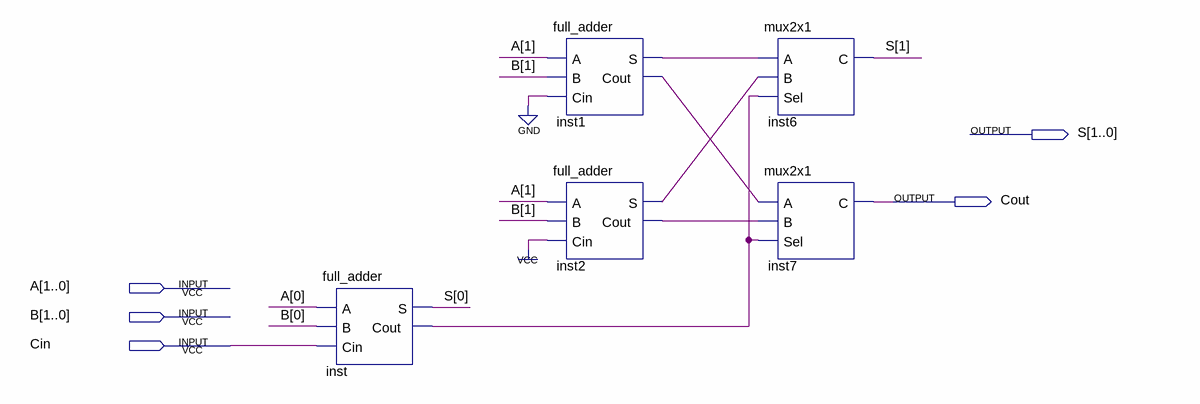
[diagram p0: schematic sheet]
// Quartus schematic full_adder2.bdf as structural Verilog: 5 symbols, 5 pins
module full_adder2 (
  input  [1:0] A,
  input  [1:0] B,
  input  Cin,
  output [1:0] S,
  output Cout
);

  wire inst1_cout, inst1_s, inst2_cout, inst2_s, inst_cout;

  full_adder inst (.A(A[0]), .B(B[0]), .Cin(Cin), .S(S[0]), .Cout(inst_cout));
  full_adder inst1 (.A(A[1]), .B(B[1]), .Cin(1'b0), .S(inst1_s), .Cout(inst1_cout));
  full_adder inst2 (.A(A[1]), .B(B[1]), .Cin(1'b1), .S(inst2_s), .Cout(inst2_cout));
  mux2x1 inst6 (.A(inst1_s), .B(inst2_s), .Sel(inst_cout), .C(S[1]));
  mux2x1 inst7 (.A(inst1_cout), .B(inst2_cout), .Sel(inst_cout), .C(Cout));
endmodule
